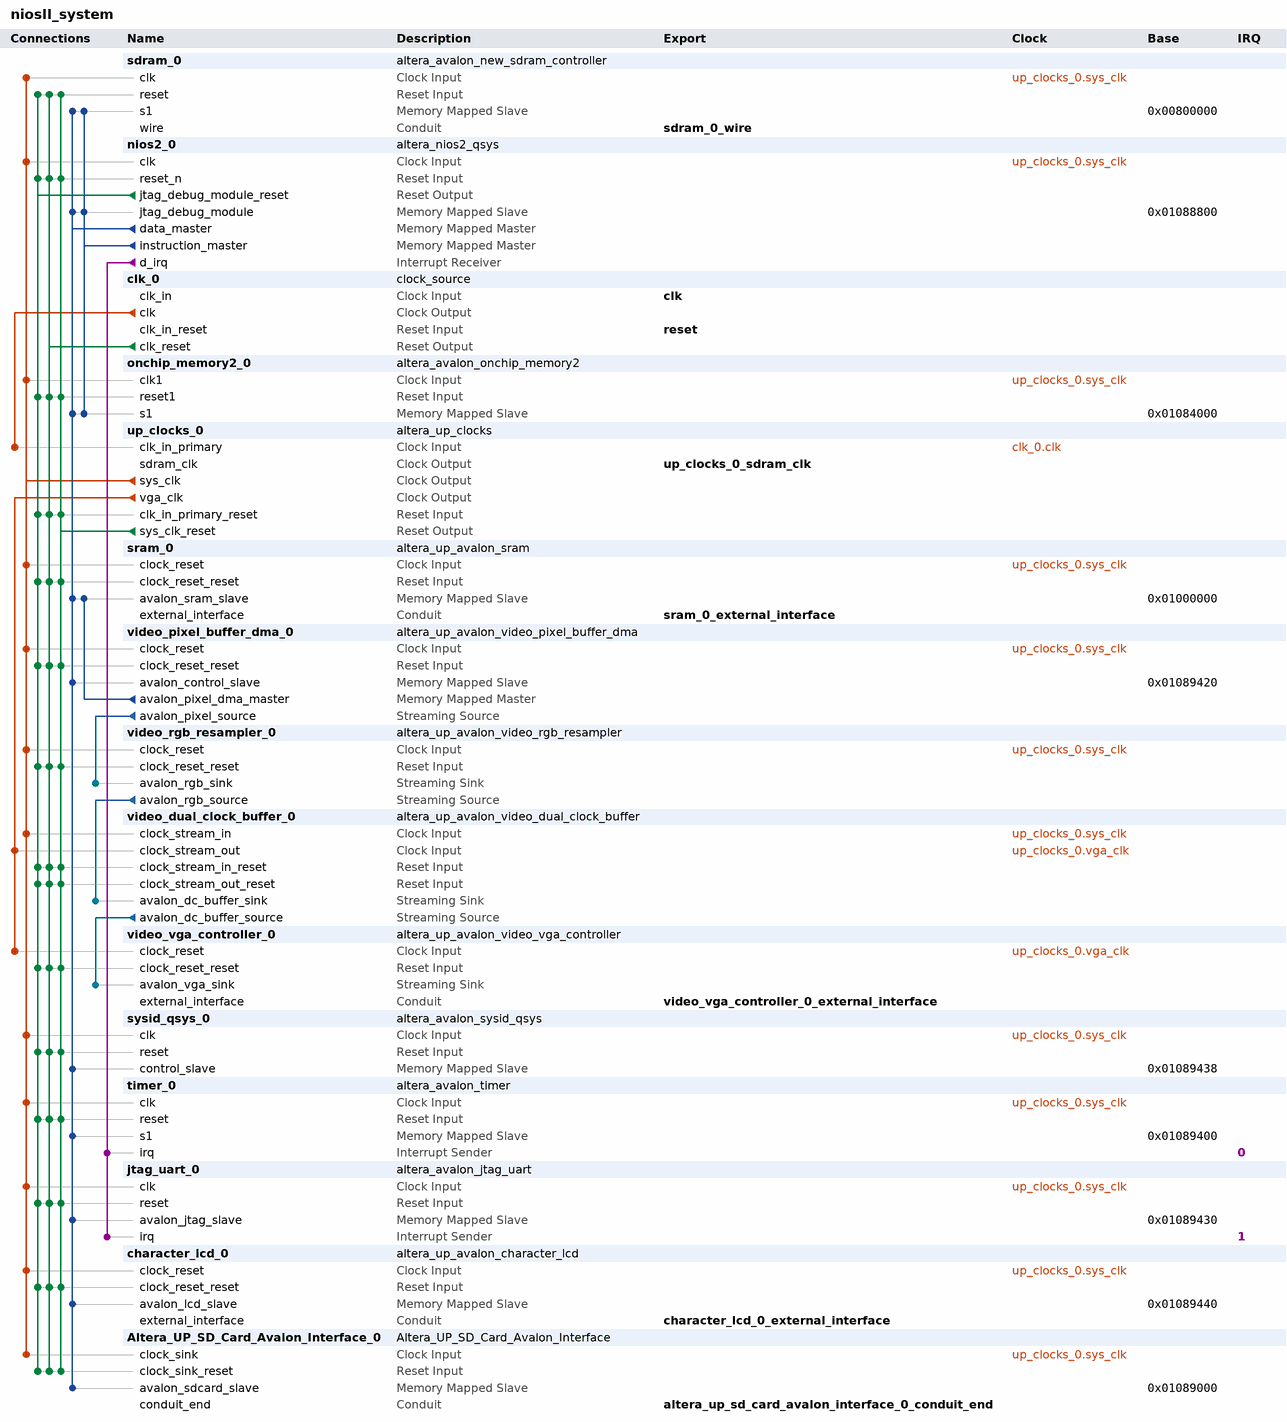
[diagram p0: system contents]
# Platform Designer (Qsys) system niosII_system, Cyclone II EP2C35F672C6
# Parameters at their usual value, and those the tool derives, are not listed.
package require -exact qsys 12.1
create_system niosII_system
set_project_property DEVICE_FAMILY {Cyclone II}
set_project_property DEVICE EP2C35F672C6

add_instance sdram_0 altera_avalon_new_sdram_controller 12.1
set_instance_parameter_value sdram_0 TAC 5.5
set_instance_parameter_value sdram_0 TRCD 20.0
set_instance_parameter_value sdram_0 TRP 20.0
set_instance_parameter_value sdram_0 casLatency 3
set_instance_parameter_value sdram_0 columnWidth 8
set_instance_parameter_value sdram_0 dataWidth 16
set_instance_parameter_value sdram_0 generateSimulationModel false
set_instance_parameter_value sdram_0 model custom
set_instance_parameter_value sdram_0 numberOfBanks 4
set_instance_parameter_value sdram_0 numberOfChipSelects 1
set_instance_parameter_value sdram_0 powerUpDelay 100.0
set_instance_parameter_value sdram_0 refreshPeriod 15.625
set_instance_parameter_value sdram_0 rowWidth 12

add_instance nios2_0 altera_nios2_qsys 12.1
set_instance_parameter_value nios2_0 resetSlave onchip_memory2_0.s1
set_instance_parameter_value nios2_0 exceptionSlave onchip_memory2_0.s1
set_instance_parameter_value nios2_0 breakSlave nios2_0.jtag_debug_module
set_instance_parameter_value nios2_0 impl Fast
set_instance_parameter_value nios2_0 icache_size 8192
set_instance_parameter_value nios2_0 icache_burstType Sequential
set_instance_parameter_value nios2_0 dcache_bursts true
set_instance_parameter_value nios2_0 dcache_size 8192

add_instance clk_0 clock_source 12.1
set_instance_parameter_value clk_0 clockFrequency 50000000

add_instance onchip_memory2_0 altera_avalon_onchip_memory2 12.1
set_instance_parameter_value onchip_memory2_0 dataWidth 32
set_instance_parameter_value onchip_memory2_0 dualPort false
set_instance_parameter_value onchip_memory2_0 initMemContent true
set_instance_parameter_value onchip_memory2_0 initializationFileName onchip_memory2_0
set_instance_parameter_value onchip_memory2_0 memorySize 16384

add_instance up_clocks_0 altera_up_clocks 12.0
set_instance_parameter_value up_clocks_0 board DE2
set_instance_parameter_value up_clocks_0 vga_clk true
set_instance_parameter_value up_clocks_0 audio_clk false
set_instance_parameter_value up_clocks_0 audio_clk_freq 12.288

add_instance sram_0 altera_up_avalon_sram 12.0
set_instance_parameter_value sram_0 board DE2
set_instance_parameter_value sram_0 pixel_buffer true

add_instance video_pixel_buffer_dma_0 altera_up_avalon_video_pixel_buffer_dma 12.0
set_instance_parameter_value video_pixel_buffer_dma_0 addr_mode X-Y
set_instance_parameter_value video_pixel_buffer_dma_0 start_address 16777216
set_instance_parameter_value video_pixel_buffer_dma_0 back_start_address 16777216
set_instance_parameter_value video_pixel_buffer_dma_0 image_width 640
set_instance_parameter_value video_pixel_buffer_dma_0 image_height 480
set_instance_parameter_value video_pixel_buffer_dma_0 color_space {8-bit RGB}

add_instance video_rgb_resampler_0 altera_up_avalon_video_rgb_resampler 12.0
set_instance_parameter_value video_rgb_resampler_0 input_type {8-bit RGB}
set_instance_parameter_value video_rgb_resampler_0 output_type {30-bit RGB}
set_instance_parameter_value video_rgb_resampler_0 alpha 1023

add_instance video_dual_clock_buffer_0 altera_up_avalon_video_dual_clock_buffer 12.0
set_instance_parameter_value video_dual_clock_buffer_0 color_bits 10

add_instance video_vga_controller_0 altera_up_avalon_video_vga_controller 12.0
set_instance_parameter_value video_vga_controller_0 board DE2

add_instance sysid_qsys_0 altera_avalon_sysid_qsys 12.1
set_instance_parameter_value sysid_qsys_0 id 0

add_instance timer_0 altera_avalon_timer 12.1
set_instance_parameter_value timer_0 period 1
set_instance_parameter_value timer_0 periodUnits MSEC
set_instance_parameter_value timer_0 timerPreset CUSTOM

add_instance jtag_uart_0 altera_avalon_jtag_uart 12.1
set_instance_parameter_value jtag_uart_0 simInteractiveOptions INTERACTIVE_INPUT_OUTPUT

add_instance character_lcd_0 altera_up_avalon_character_lcd 12.0
set_instance_parameter_value character_lcd_0 cursor Normal

add_instance Altera_UP_SD_Card_Avalon_Interface_0 Altera_UP_SD_Card_Avalon_Interface 1.0

# connections
add_connection clk_0.clk up_clocks_0.clk_in_primary clock
add_connection up_clocks_0.sys_clk Altera_UP_SD_Card_Avalon_Interface_0.clock_sink clock
add_connection up_clocks_0.sys_clk character_lcd_0.clock_reset clock
add_connection up_clocks_0.sys_clk jtag_uart_0.clk clock
add_connection up_clocks_0.sys_clk nios2_0.clk clock
add_connection up_clocks_0.sys_clk onchip_memory2_0.clk1 clock
add_connection up_clocks_0.sys_clk sdram_0.clk clock
add_connection up_clocks_0.sys_clk sram_0.clock_reset clock
add_connection up_clocks_0.sys_clk sysid_qsys_0.clk clock
add_connection up_clocks_0.sys_clk timer_0.clk clock
add_connection up_clocks_0.sys_clk video_dual_clock_buffer_0.clock_stream_in clock
add_connection up_clocks_0.sys_clk video_pixel_buffer_dma_0.clock_reset clock
add_connection up_clocks_0.sys_clk video_rgb_resampler_0.clock_reset clock
add_connection up_clocks_0.vga_clk video_dual_clock_buffer_0.clock_stream_out clock
add_connection up_clocks_0.vga_clk video_vga_controller_0.clock_reset clock
add_connection clk_0.clk_reset Altera_UP_SD_Card_Avalon_Interface_0.clock_sink_reset reset
add_connection clk_0.clk_reset character_lcd_0.clock_reset_reset reset
add_connection clk_0.clk_reset jtag_uart_0.reset reset
add_connection clk_0.clk_reset nios2_0.reset_n reset
add_connection clk_0.clk_reset onchip_memory2_0.reset1 reset
add_connection clk_0.clk_reset sdram_0.reset reset
add_connection clk_0.clk_reset sram_0.clock_reset_reset reset
add_connection clk_0.clk_reset sysid_qsys_0.reset reset
add_connection clk_0.clk_reset timer_0.reset reset
add_connection clk_0.clk_reset up_clocks_0.clk_in_primary_reset reset
add_connection clk_0.clk_reset video_dual_clock_buffer_0.clock_stream_in_reset reset
add_connection clk_0.clk_reset video_dual_clock_buffer_0.clock_stream_out_reset reset
add_connection clk_0.clk_reset video_pixel_buffer_dma_0.clock_reset_reset reset
add_connection clk_0.clk_reset video_rgb_resampler_0.clock_reset_reset reset
add_connection clk_0.clk_reset video_vga_controller_0.clock_reset_reset reset
add_connection nios2_0.jtag_debug_module_reset Altera_UP_SD_Card_Avalon_Interface_0.clock_sink_reset reset
add_connection nios2_0.jtag_debug_module_reset character_lcd_0.clock_reset_reset reset
add_connection nios2_0.jtag_debug_module_reset jtag_uart_0.reset reset
add_connection nios2_0.jtag_debug_module_reset nios2_0.reset_n reset
add_connection nios2_0.jtag_debug_module_reset onchip_memory2_0.reset1 reset
add_connection nios2_0.jtag_debug_module_reset sdram_0.reset reset
add_connection nios2_0.jtag_debug_module_reset sram_0.clock_reset_reset reset
add_connection nios2_0.jtag_debug_module_reset sysid_qsys_0.reset reset
add_connection nios2_0.jtag_debug_module_reset timer_0.reset reset
add_connection nios2_0.jtag_debug_module_reset up_clocks_0.clk_in_primary_reset reset
add_connection nios2_0.jtag_debug_module_reset video_dual_clock_buffer_0.clock_stream_in_reset reset
add_connection nios2_0.jtag_debug_module_reset video_dual_clock_buffer_0.clock_stream_out_reset reset
add_connection nios2_0.jtag_debug_module_reset video_pixel_buffer_dma_0.clock_reset_reset reset
add_connection nios2_0.jtag_debug_module_reset video_rgb_resampler_0.clock_reset_reset reset
add_connection nios2_0.jtag_debug_module_reset video_vga_controller_0.clock_reset_reset reset
add_connection up_clocks_0.sys_clk_reset Altera_UP_SD_Card_Avalon_Interface_0.clock_sink_reset reset
add_connection up_clocks_0.sys_clk_reset character_lcd_0.clock_reset_reset reset
add_connection up_clocks_0.sys_clk_reset jtag_uart_0.reset reset
add_connection up_clocks_0.sys_clk_reset nios2_0.reset_n reset
add_connection up_clocks_0.sys_clk_reset onchip_memory2_0.reset1 reset
add_connection up_clocks_0.sys_clk_reset sdram_0.reset reset
add_connection up_clocks_0.sys_clk_reset sram_0.clock_reset_reset reset
add_connection up_clocks_0.sys_clk_reset sysid_qsys_0.reset reset
add_connection up_clocks_0.sys_clk_reset timer_0.reset reset
add_connection up_clocks_0.sys_clk_reset up_clocks_0.clk_in_primary_reset reset
add_connection up_clocks_0.sys_clk_reset video_dual_clock_buffer_0.clock_stream_in_reset reset
add_connection up_clocks_0.sys_clk_reset video_dual_clock_buffer_0.clock_stream_out_reset reset
add_connection up_clocks_0.sys_clk_reset video_pixel_buffer_dma_0.clock_reset_reset reset
add_connection up_clocks_0.sys_clk_reset video_rgb_resampler_0.clock_reset_reset reset
add_connection up_clocks_0.sys_clk_reset video_vga_controller_0.clock_reset_reset reset
add_connection nios2_0.data_master Altera_UP_SD_Card_Avalon_Interface_0.avalon_sdcard_slave avalon
set_connection_parameter_value nios2_0.data_master/Altera_UP_SD_Card_Avalon_Interface_0.avalon_sdcard_slave baseAddress 0x01089000
add_connection nios2_0.data_master character_lcd_0.avalon_lcd_slave avalon
set_connection_parameter_value nios2_0.data_master/character_lcd_0.avalon_lcd_slave baseAddress 0x01089440
add_connection nios2_0.data_master jtag_uart_0.avalon_jtag_slave avalon
set_connection_parameter_value nios2_0.data_master/jtag_uart_0.avalon_jtag_slave baseAddress 0x01089430
add_connection nios2_0.data_master nios2_0.jtag_debug_module avalon
set_connection_parameter_value nios2_0.data_master/nios2_0.jtag_debug_module baseAddress 0x01088800
add_connection nios2_0.data_master onchip_memory2_0.s1 avalon
set_connection_parameter_value nios2_0.data_master/onchip_memory2_0.s1 baseAddress 0x01084000
add_connection nios2_0.data_master sdram_0.s1 avalon
set_connection_parameter_value nios2_0.data_master/sdram_0.s1 baseAddress 0x00800000
add_connection nios2_0.data_master sram_0.avalon_sram_slave avalon
set_connection_parameter_value nios2_0.data_master/sram_0.avalon_sram_slave baseAddress 0x01000000
add_connection nios2_0.data_master sysid_qsys_0.control_slave avalon
set_connection_parameter_value nios2_0.data_master/sysid_qsys_0.control_slave baseAddress 0x01089438
add_connection nios2_0.data_master timer_0.s1 avalon
set_connection_parameter_value nios2_0.data_master/timer_0.s1 baseAddress 0x01089400
add_connection nios2_0.data_master video_pixel_buffer_dma_0.avalon_control_slave avalon
set_connection_parameter_value nios2_0.data_master/video_pixel_buffer_dma_0.avalon_control_slave baseAddress 0x01089420
add_connection nios2_0.instruction_master nios2_0.jtag_debug_module avalon
set_connection_parameter_value nios2_0.instruction_master/nios2_0.jtag_debug_module baseAddress 0x01088800
add_connection nios2_0.instruction_master onchip_memory2_0.s1 avalon
set_connection_parameter_value nios2_0.instruction_master/onchip_memory2_0.s1 baseAddress 0x01084000
add_connection nios2_0.instruction_master sdram_0.s1 avalon
set_connection_parameter_value nios2_0.instruction_master/sdram_0.s1 baseAddress 0x00800000
add_connection video_pixel_buffer_dma_0.avalon_pixel_dma_master sram_0.avalon_sram_slave avalon
set_connection_parameter_value video_pixel_buffer_dma_0.avalon_pixel_dma_master/sram_0.avalon_sram_slave baseAddress 0x01000000
add_connection video_dual_clock_buffer_0.avalon_dc_buffer_source video_vga_controller_0.avalon_vga_sink avalon_streaming
add_connection video_pixel_buffer_dma_0.avalon_pixel_source video_rgb_resampler_0.avalon_rgb_sink avalon_streaming
add_connection video_rgb_resampler_0.avalon_rgb_source video_dual_clock_buffer_0.avalon_dc_buffer_sink avalon_streaming
add_connection nios2_0.d_irq jtag_uart_0.irq interrupt
set_connection_parameter_value nios2_0.d_irq/jtag_uart_0.irq irqNumber 1
add_connection nios2_0.d_irq timer_0.irq interrupt
set_connection_parameter_value nios2_0.d_irq/timer_0.irq irqNumber 0

# exported interfaces
add_interface clk clock sink
set_interface_property clk EXPORT_OF clk_0.clk_in
add_interface reset reset sink
set_interface_property reset EXPORT_OF clk_0.clk_in_reset
add_interface character_lcd_0_external_interface conduit end
set_interface_property character_lcd_0_external_interface EXPORT_OF character_lcd_0.external_interface
add_interface sram_0_external_interface conduit end
set_interface_property sram_0_external_interface EXPORT_OF sram_0.external_interface
add_interface video_vga_controller_0_external_interface conduit end
set_interface_property video_vga_controller_0_external_interface EXPORT_OF video_vga_controller_0.external_interface
add_interface altera_up_sd_card_avalon_interface_0_conduit_end conduit end
set_interface_property altera_up_sd_card_avalon_interface_0_conduit_end EXPORT_OF Altera_UP_SD_Card_Avalon_Interface_0.conduit_end
add_interface sdram_0_wire conduit end
set_interface_property sdram_0_wire EXPORT_OF sdram_0.wire
add_interface up_clocks_0_sdram_clk clock source
set_interface_property up_clocks_0_sdram_clk EXPORT_OF up_clocks_0.sdram_clk

save_system niosII_system.qsys
